# Altium schematic sheet power.SchDoc
size A4; SheetNumber: 3; SheetTotal: 4
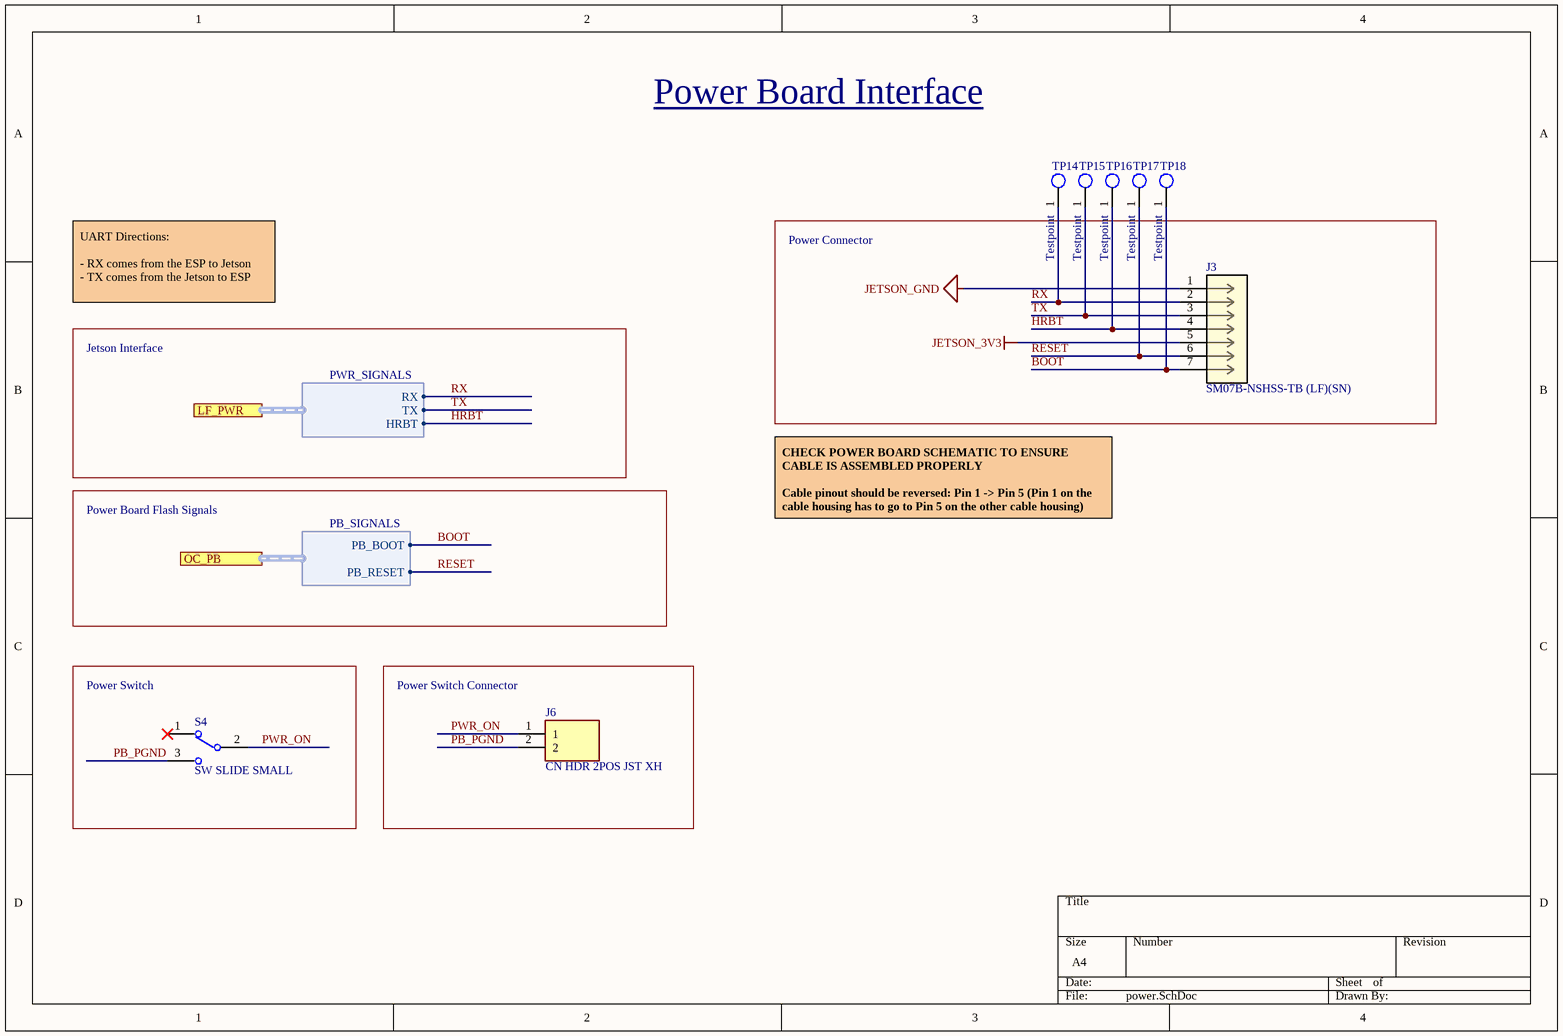
[diagram p0: power.SchDoc]

## Parts
J3  SM07B-NSHSS-TB (LF)(SN)  [JST_SM07B-NSHSS-TB_(LF)(SN)]
J6  CN HDR 2POS JST XH  [JST_B2B-XH-A(LF)(SN)]
S4  SW SLIDE SMALL  [SW SLIDE SMALL]
TP14  Testpoint  [TP_1mm]
TP15  Testpoint  [TP_1mm]
TP16  Testpoint  [TP_1mm]
TP17  Testpoint  [TP_1mm]
TP18  Testpoint  [TP_1mm]

## Blocks framed on the sheet
Power Connector: J3
Power Switch: S4
Power Switch Connector: J6

## Ports
LF_PWR (harness PWR_SIGNALS), OC_PB (harness PB_SIGNALS)

## Harnesses
PWR_SIGNALS: TX, RX, HRBT
PB_SIGNALS: PB_BOOT, PB_RESET

## Nets
JETSON_3V3: J3.5
JETSON_GND: J3.1
BOOT: J3.7 TP18.1(TP) ; port OC_PB.PB_BOOT
HRBT: J3.4 TP16.1(TP) ; port LF_PWR.HRBT
PB_PGND: J6.2 S4.3
PWR_ON: J6.1 S4.2
RESET: J3.6 TP17.1(TP) ; port OC_PB.PB_RESET
RX: J3.2 TP14.1(TP) ; port LF_PWR.RX
TX: J3.3 TP15.1(TP) ; port LF_PWR.TX

Not connected (* = marked no-connect by the designer): S4 1*

## Notes on the sheet
- Power Board Interface
- UART Directions:
  - RX comes from the ESP to Jetson
  - TX comes from the Jetson to ESP
- Jetson Interface
- Power Board Flash Signals
- CHECK POWER BOARD SCHEMATIC TO ENSURE CABLE IS ASSEMBLED PROPERLY
  Cable pinout should be reversed: Pin 1 -> Pin 5 (Pin 1 on the cable housing has to go to Pin 5 on the other cable housing)

## Library data of the parts
J3 = CN 7POS JST NSH SMT RA: Connector Header Surface Mount, Right Angle 7 position 0.039" (1.00mm); MP: SM12B-NSHSS-TB (LF)(SN); MF: JST Sales America Inc.; Package: None; Check_prices: https://www.snapeda.com/parts/SM12B-NSHSS-TB%20(LF)(SN)/JST%20Sales%20America%20Inc./view-part/5255521/?ref=eda; Value: *; Availability: Unavailable; Price: None; SnapEDA_Link: https://www.snapeda.com/parts/SM12B-NSHSS-TB%20(LF)(SN)/JST%20Sales%20America%20Inc./view-part/5255521/?ref=snap; Supplier 1: Digi-Key; Supplier 2: Digi-Key; Supplier 3: Digi-Key; Supplier 4: Digi-Key; Supplier Part Number 1: 455-2771-1-ND; Supplier Part Number 2: 455-2771-1-ND; Supplier Part Number 3: 455-2771-6-ND; Supplier Part Number 4: 455-2771-2-ND; Part Number: CN 7POS JST NSH SMT RA; Supplier URL 1: https://www.digikey.ca/en/products/detail/jst-sales-america-inc/SM07B-NSHSS-TB-LF-SN/3313637; Pin Count: 7
J6 = CN HDR 2POS JST XH: Connector Header Through Hole 2 position 0.098 _2.50mm_ / JST XH; MP: B2B-XH-A_LF__SN_; MF: JST Sales; Price: None; Package: None; Value: *; SnapEDA_Link: https://www.snapeda.com/parts/B2B-XH-A%28LF%29%28SN%29/JST%20Sales%20America%20Inc./view-part/492310/?ref=snap; Part Number: CN HDR 2POS JST XH; Pin Count: 2
S4 = SW SLIDE SMALL: Slide Switch SPDT Surface Mount, Right Angle; Manufacturer Part Number 1: JS102011SAQN SPDT; MF: C&K; MP: JS102011SAQN; Availability: Unavailable; Price: None; SnapEDA_Link: https://www.snapeda.com/parts/JS102011SAQN/C%26K/view-part/214325/?ref=snap; Value: *; Package: None; Part Number: SW SLIDE SMALL; Supplier 1: Digi-key; Supplier Part Number 1: JS102011SAQN SPDT; Supplier URL 1: https://www.digikey.ca/en/products/detail/c-k/JS102011SAQN/1640095
TP14-TP18 = TP_1MM: Part Number: TP_1MM